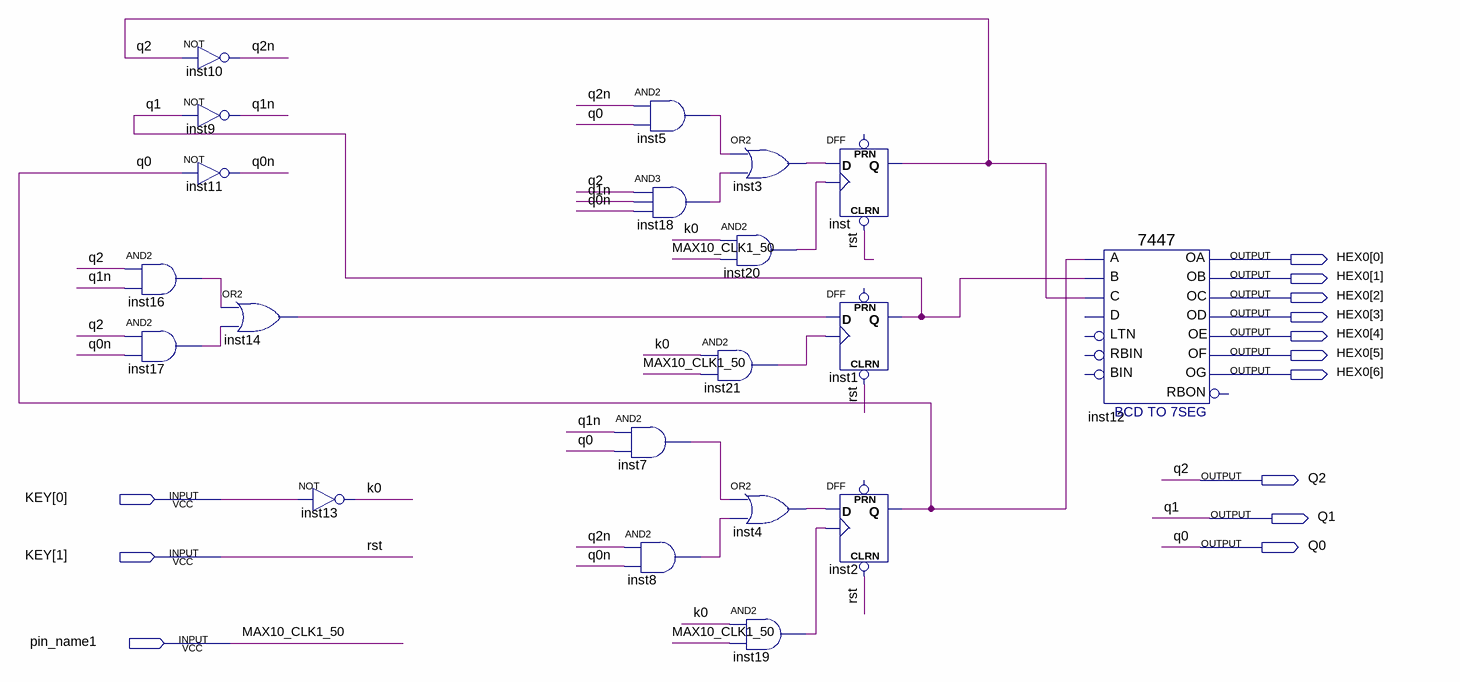
[diagram p0: schematic sheet]
// Quartus schematic roll.bdf as structural Verilog: 20 symbols, 13 pins
module roll (
  input  [1:0] KEY,
  input  pin_name1,
  output [6:0] HEX0,
  output Q2,
  output Q1,
  output Q0
);

  wire inst3_out, inst4_out, inst5_out, inst7_out, inst8_out, inst14_out, inst16_out, inst17_out, inst18_out,
       inst19_out, inst20_out, inst21_out, k0, q0n, q1n, q2n;

  and inst16 (inst16_out, Q2, q1n);
  and inst17 (inst17_out, Q2, q0n);
  not inst10 (q2n, Q2);
  not inst9 (q1n, Q1);
  not inst11 (q0n, Q0);
  or inst14 (inst14_out, inst16_out, inst17_out);
  not inst13 (k0, KEY[0]);
  and inst5 (inst5_out, q2n, Q0);
  and inst18 (inst18_out, Q2, q1n, q0n);
  and inst7 (inst7_out, q1n, Q0);
  and inst8 (inst8_out, q2n, q0n);
  and inst21 (inst21_out, k0, pin_name1);
  or inst3 (inst3_out, inst5_out, inst18_out);
  and inst20 (inst20_out, k0, pin_name1);
  or inst4 (inst4_out, inst7_out, inst8_out);
  and inst19 (inst19_out, k0, pin_name1);
  DFF inst (.CLRN(KEY[1]), .CLK(inst20_out), .D(inst3_out), .Q(Q2));  // open: PRN
  DFF inst1 (.CLRN(KEY[1]), .CLK(inst21_out), .D(inst14_out), .Q(Q1));  // open: PRN
  DFF inst2 (.CLRN(KEY[1]), .CLK(inst19_out), .D(inst4_out), .Q(Q0));  // open: PRN
  \7447  inst12 (
    .B(Q1), .C(Q2), .A(Q0), .OB(HEX0[1]), .OC(HEX0[2]), .OE(HEX0[4]), .OD(HEX0[3]), .OF(HEX0[5]),
    .OG(HEX0[6]), .OA(HEX0[0]));  // open: LTN, D, RBIN, BIN, RBON

  // Other names for the same wires on the sheet: MAX10_CLK1_50 = pin_name1; rst = KEY[1]
endmodule
